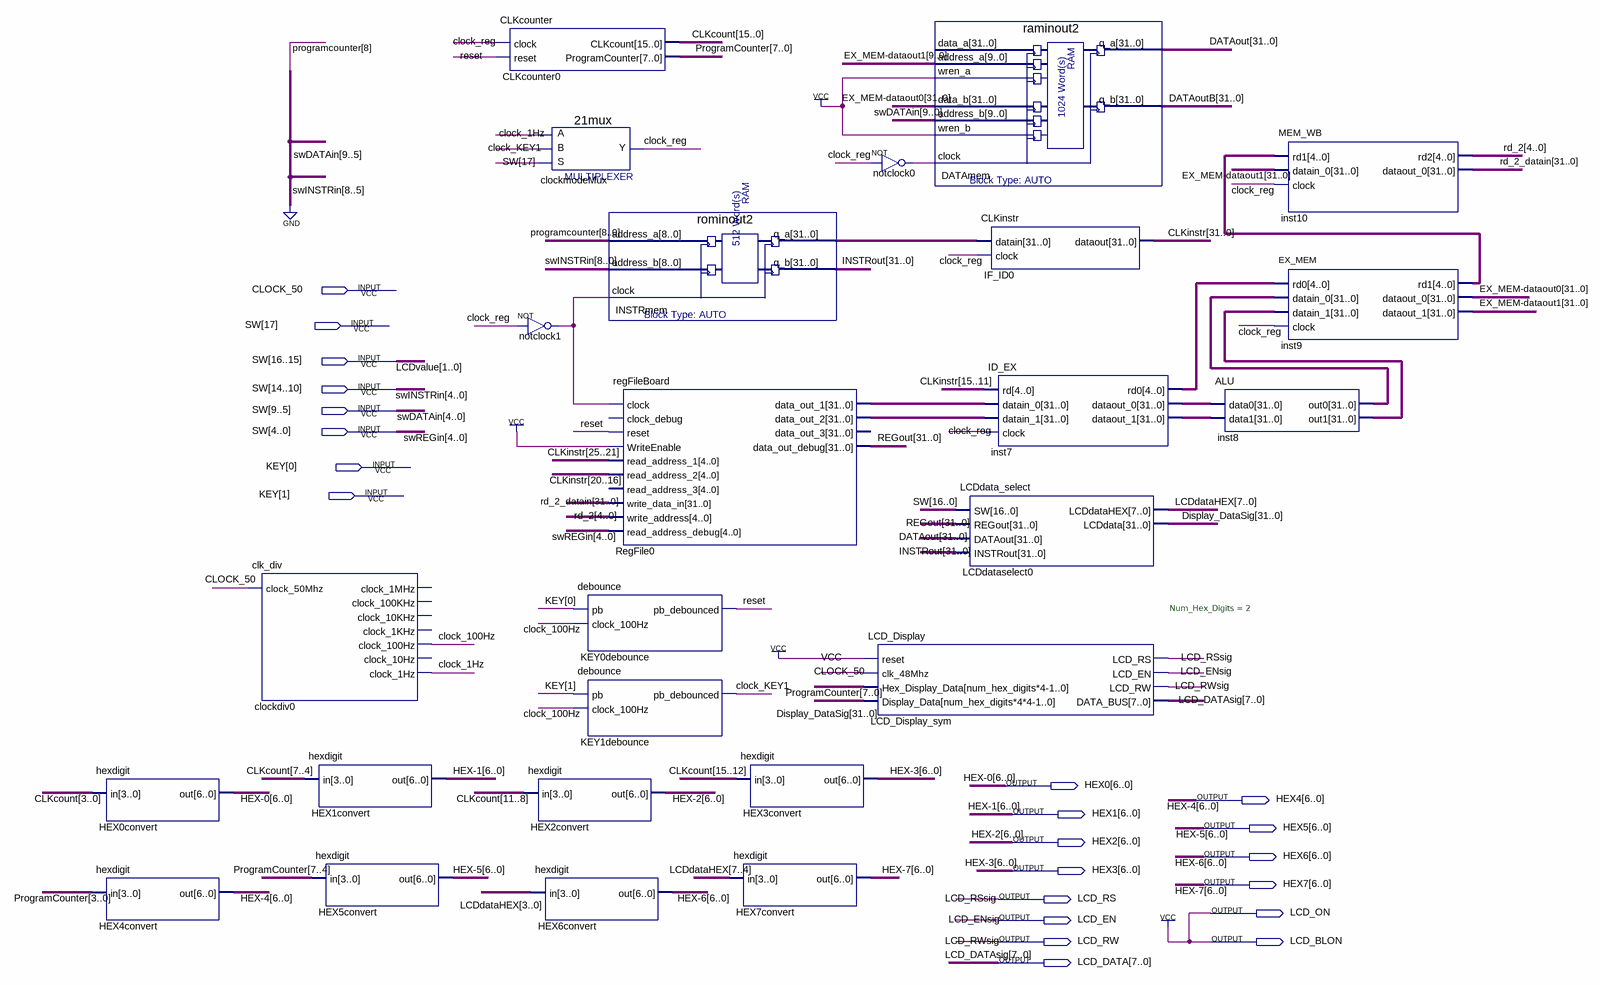
[diagram p0: schematic sheet]
// Quartus schematic control.bdf as structural Verilog: 25 symbols, 22 pins
module control (
  input  CLOCK_50,
  input  [17:0] SW,
  input  [1:0] KEY,
  output [6:0] HEX0,
  output [6:0] HEX4,
  output [6:0] HEX1,
  output [6:0] HEX5,
  output [6:0] HEX2,
  output [6:0] HEX6,
  output [6:0] HEX3,
  output [6:0] HEX7,
  output LCD_RS,
  output LCD_ON,
  output LCD_EN,
  output LCD_RW,
  output LCD_BLON,
  output [7:0] LCD_DATA
);

  wire clock_1Hz, clock_100Hz, clock_KEY1, clock_reg, notclock0_out, notclock1_out, reset;
  wire [4:0] inst7_rd0, inst9_rd1, rd_2;
  wire [7:0] LCDdataHEX;
  wire [8:0] ProgramCounter;
  wire [8:5] swINSTRin;
  wire [15:0] CLKcount;
  wire [31:0] CLKinstr, DATAout, DATAoutB, Display_DataSig, \EX_MEM-dataout0 , \EX_MEM-dataout1 ,
       inst7_dataout_0, inst7_dataout_1, inst8_out0, inst8_out1, INSTRmem_q_a, INSTRout, rd_2_datain,
       RegFile0_data_out_1, RegFile0_data_out_2, REGout;

  hexdigit HEX0convert (.in(CLKcount[3:0]), .out(HEX0));
  hexdigit HEX4convert (.in(ProgramCounter[3:0]), .out(HEX4));
  clk_div clockdiv0 (
    .clock_50Mhz(CLOCK_50), .clock_100Hz(clock_100Hz), .clock_1Hz(clock_1Hz));  // open: clock_1MHz, clock_100KHz, clock_10KHz, clock_1KHz, clock_10Hz
  hexdigit HEX1convert (.in(CLKcount[7:4]), .out(HEX1));
  hexdigit HEX5convert (.in(ProgramCounter[7:4]), .out(HEX5));
  CLKcounter CLKcounter0 (.clock(clock_reg), .reset(reset), .CLKcount(CLKcount), .ProgramCounter(ProgramCounter[7:0]));
  not notclock1 (notclock1_out, clock_reg);
  hexdigit HEX2convert (.in(CLKcount[11:8]), .out(HEX2));
  \21mux  clockmodeMux (.S(SW[17]), .B(clock_KEY1), .A(clock_1Hz), .Y(clock_reg));
  debounce KEY0debounce (.pb(KEY[0]), .clock_100Hz(clock_100Hz), .pb_debounced(reset));
  debounce KEY1debounce (.pb(KEY[1]), .clock_100Hz(clock_100Hz), .pb_debounced(clock_KEY1));
  hexdigit HEX6convert (.in(LCDdataHEX[3:0]), .out(HEX6));
  rominout2 INSTRmem (
    .address_a(ProgramCounter), .address_b({swINSTRin, SW[14:10]}), .clock(notclock1_out),
    .q_a(INSTRmem_q_a), .q_b(INSTRout));
  regFileBoard RegFile0 (
    .clock(notclock1_out), .reset(reset), .WriteEnable(1'b1), .read_address_1(CLKinstr[25:21]),
    .read_address_2(CLKinstr[20:16]), .write_data_in(rd_2_datain), .write_address(rd_2),
    .read_address_debug(SW[4:0]), .data_out_1(RegFile0_data_out_1), .data_out_2(RegFile0_data_out_2),
    .data_out_debug(REGout));  // open: clock_debug, read_address_3, data_out_3
  hexdigit HEX3convert (.in(CLKcount[15:12]), .out(HEX3));
  hexdigit HEX7convert (.in(LCDdataHEX[7:4]), .out(HEX7));
  LCD_Display #(.Num_Hex_Digits(2)) LCD_Display_sym (
    .reset(1'b1), .clk_48Mhz(CLOCK_50), .Hex_Display_Data(ProgramCounter[7:0]),
    .Display_Data(Display_DataSig), .LCD_RS(LCD_RS), .LCD_EN(LCD_EN), .LCD_RW(LCD_RW), .DATA_BUS(LCD_DATA));
  not notclock0 (notclock0_out, clock_reg);
  raminout2 DATAmem (
    .address_a(\EX_MEM-dataout1 [9:0]), .wren_a(1'b1), .data_b(\EX_MEM-dataout0 ),
    .address_b({{5{1'b0}}, SW[9:5]}), .wren_b(1'b1), .clock(notclock0_out), .q_a(DATAout), .q_b(DATAoutB));  // open: data_a
  CLKinstr IF_ID0 (.datain(INSTRmem_q_a), .clock(clock_reg), .dataout(CLKinstr));
  LCDdata_select LCDdataselect0 (
    .SW(SW[16:0]), .REGout(REGout), .DATAout(DATAout), .INSTRout(INSTRout), .LCDdataHEX(LCDdataHEX),
    .LCDdata(Display_DataSig));
  ID_EX inst7 (
    .rd(CLKinstr[15:11]), .datain_0(RegFile0_data_out_1), .datain_1(RegFile0_data_out_2), .clock(clock_reg),
    .rd0(inst7_rd0), .dataout_0(inst7_dataout_0), .dataout_1(inst7_dataout_1));
  ALU inst8 (.data0(inst7_dataout_0), .data1(inst7_dataout_1), .out0(inst8_out0), .out1(inst8_out1));
  MEM_WB inst10 (.rd1(inst9_rd1), .datain_0(\EX_MEM-dataout1 ), .clock(clock_reg), .rd2(rd_2), .dataout_0(rd_2_datain));
  EX_MEM inst9 (
    .rd0(inst7_rd0), .datain_0(inst8_out0), .datain_1(inst8_out1), .clock(clock_reg), .rd1(inst9_rd1),
    .dataout_0(\EX_MEM-dataout0 ), .dataout_1(\EX_MEM-dataout1 ));

  assign LCD_BLON = 1'b1;
  assign LCD_ON = 1'b1;

  // Other names for the same wires on the sheet: HEX-0[6:0] = HEX0; HEX-1[6:0] = HEX1; HEX-2[6:0] = HEX2;
  //   HEX-3[6:0] = HEX3; HEX-4[6:0] = HEX4; HEX-5[6:0] = HEX5; HEX-6[6:0] = HEX6; HEX-7[6:0] = HEX7;
  //   LCD_DATAsig[7:0] = LCD_DATA; LCD_ENsig = LCD_EN; LCD_RSsig = LCD_RS; LCD_RWsig = LCD_RW;
  //   LCDvalue[1:0] = SW[16:15]; swDATAin[4:0] = SW[9:5]; swINSTRin[4:0] = SW[14:10]; swREGin[4:0] = SW[4:0]
endmodule
